# Altium project MCPS Power 0305.PrjPcb
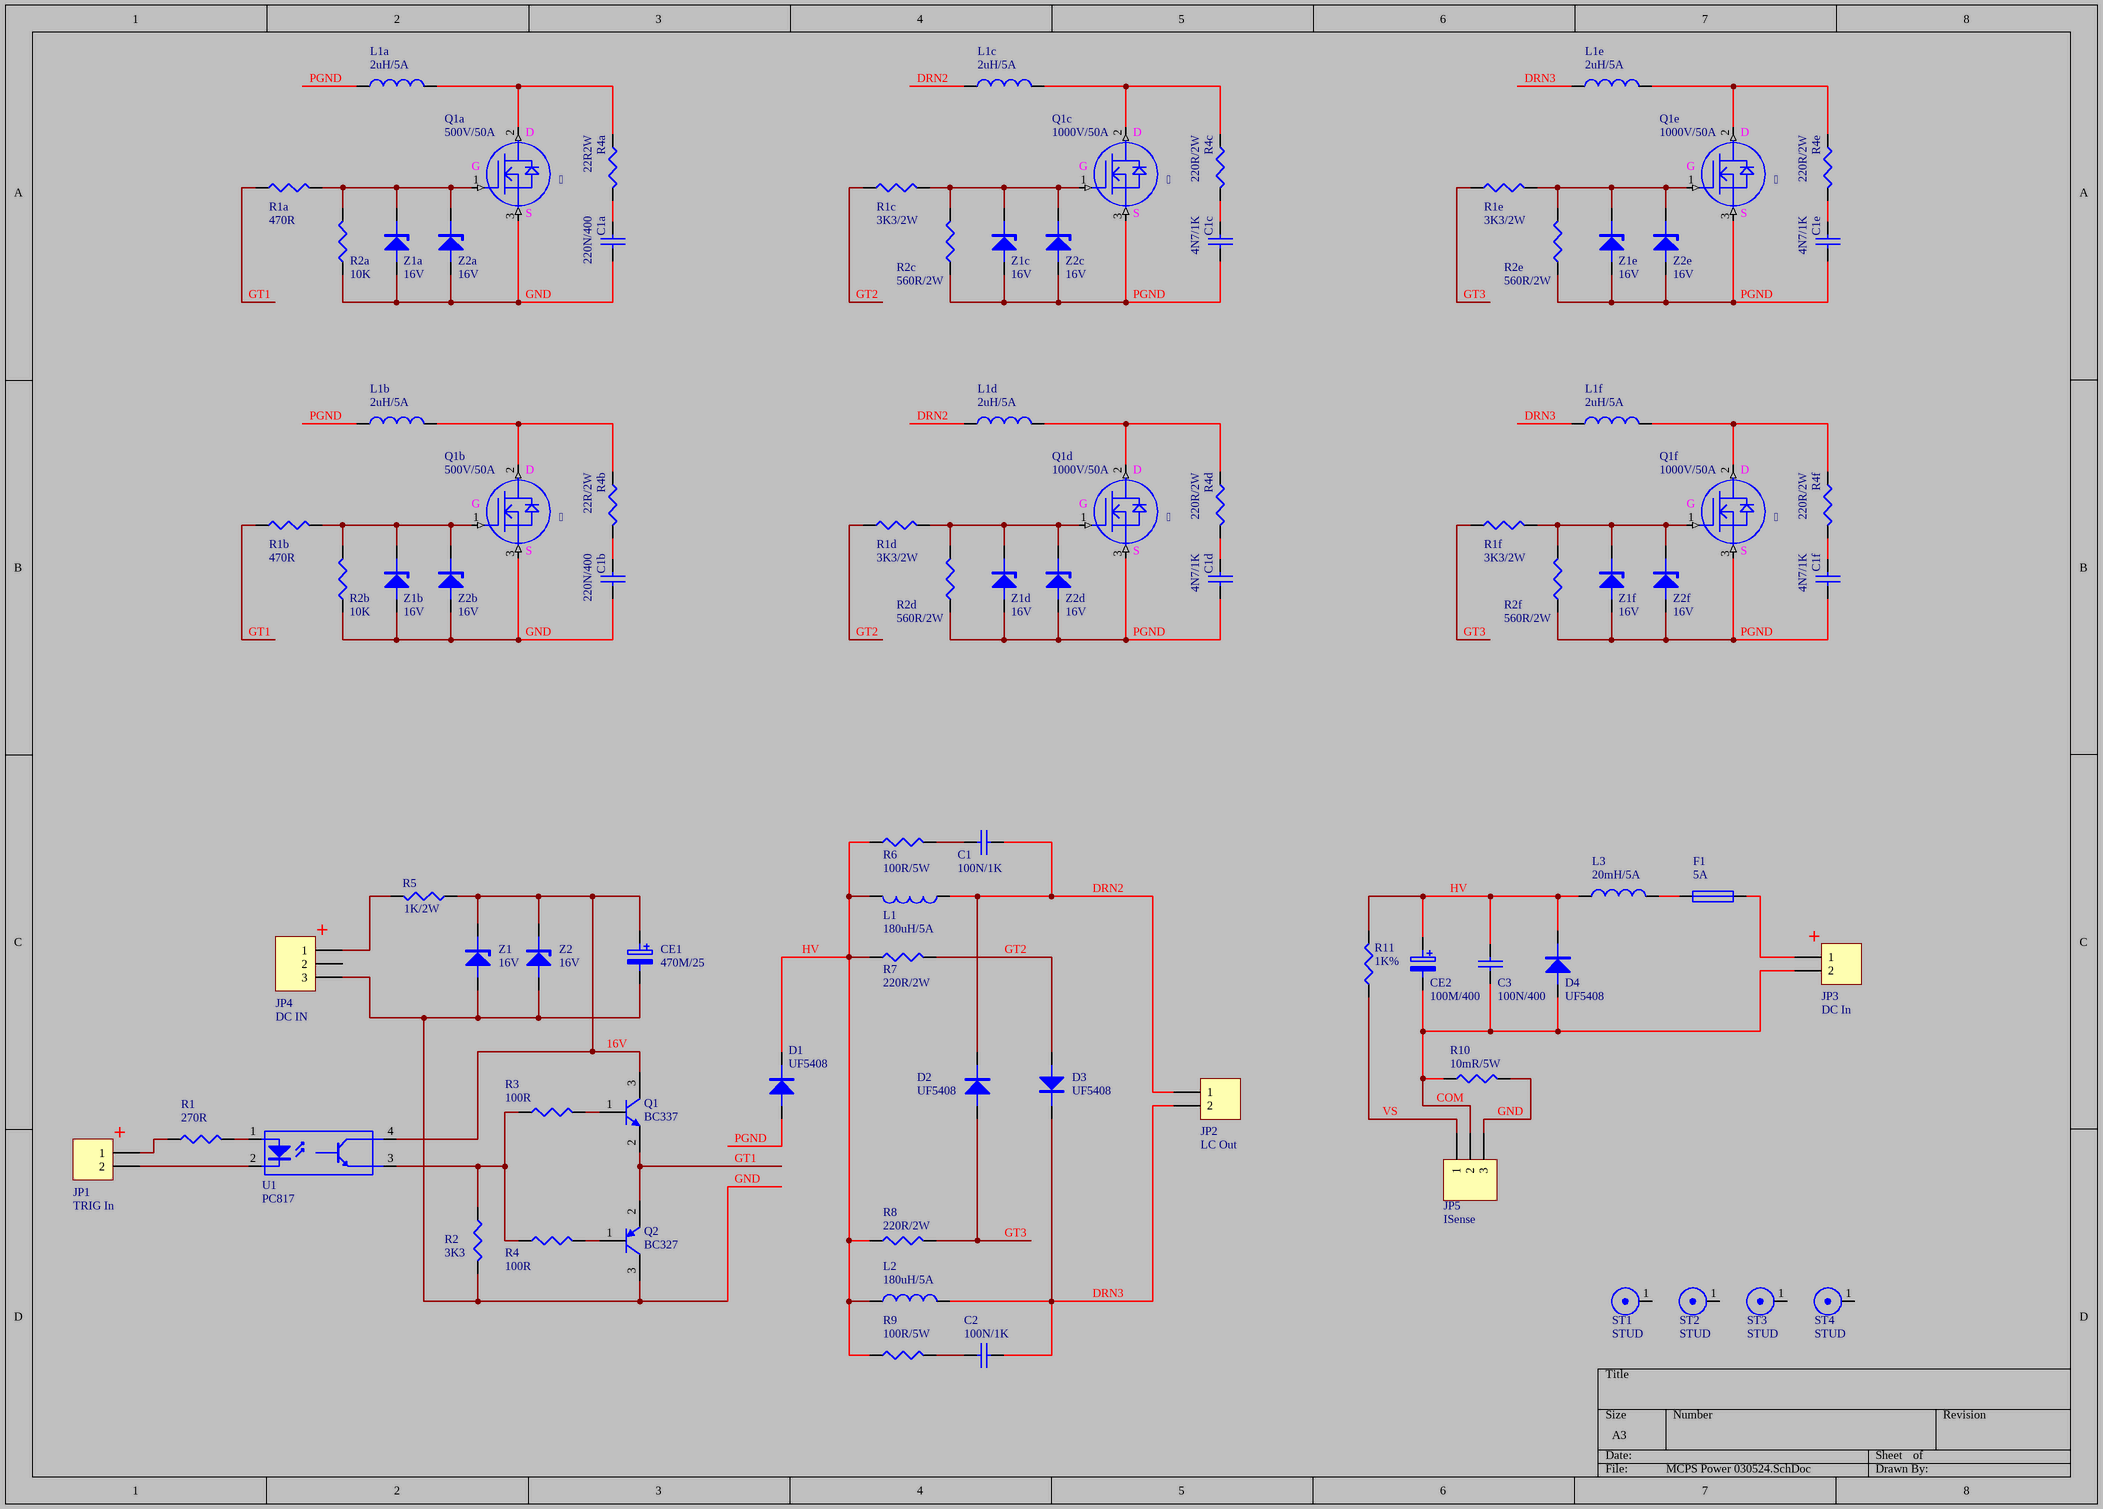
[diagram p0: MCPS Power 030524.SchDoc]
1 sheet, 86 parts. Net scope: global (net labels, ports and power ports of the same name join across sheets).
Board file: MCPS Power 030524.PcbDoc

## Sheet MCPS Power 030524.SchDoc
size A3

### Parts
C1  100N/1K  [C100N]
C1a  220N/400  [C4P]
C1b  220N/400  [C4P]
C1c  4N7/1K  [C4P]
C1d  4N7/1K  [C4P]
C1e  4N7/1K  [C4P]
C1f  4N7/1K  [C4P]
C2  100N/1K  [C100N]
C3  100N/400  [C4P]
CE1  470M/25  [cap2p12]
CE2  100M/400  [CAP3P5]
D1  UF5408  [D54]
D2  UF5408  [D54]
D3  UF5408  [D54]
D4  UF5408  [D54]
F1  5A  [FL]
JP1  TRIG In  [DSIP2]
JP2  LC Out  [DG55X2]
JP3  DC In  [DG55X2]
JP4  DC IN  [DSIP3]
JP5  ISense  [DSIP3]
L1  180uH/5A  [L20MHGREEN]
L1a  2uH/5A  [LS_GREEN]
L1b  2uH/5A  [LS_GREEN]
L1c  2uH/5A  [LS_GREEN]
L1d  2uH/5A  [LS_GREEN]
L1e  2uH/5A  [LS_GREEN]
L1f  2uH/5A  [LS_GREEN]
L2  180uH/5A  [L20MHGREEN]
L3  20mH/5A  [L20MHGREEN]
Q1  BC337  [CBE-BC546]
Q1a    [3EDG-STR]
Q1b    [3EDG-STR]
Q1c    [3EDG-STR]
Q1d    [3EDG-STR]
Q1e    [3EDG-STR]
Q1f    [3EDG-STR]
Q2  BC327  [CBE-BC546]
R1  270R  [W1/4]
R1a  470R  [R5P]
R1b  470R  [R5P]
R1c  3K3/2W  [R2W]
R1d  3K3/2W  [R2W]
R1e  3K3/2W  [R2W]
R1f  3K3/2W  [R2W]
R2  3K3  [W1/4]
R2a  10K  [R5P]
R2b  10K  [R5P]
R2c  560R/2W  [R2W]
R2d  560R/2W  [R2W]
R2e  560R/2W  [R2W]
R2f  560R/2W  [R2W]
R3  100R  [W1/4]
R4  100R  [W1/4]
R4a  22R2W  [R2W]
R4b  22R/2W  [R2W]
R4c  220R/2W  [R2W]
R4d  220R/2W  [R2W]
R4e  220R/2W  [R2W]
R4f  220R/2W  [R2W]
R5  1K/2W  [R2W]
R6  100R/5W  [R5W]
R7  220R/2W  [R2W]
R8  220R/2W  [R2W]
R9  100R/5W  [R5W]
R10  10mR/5W  [R5W]
R11  1K%  [R5P]
ST1  STUD  [CORNER]
ST2  STUD  [CORNER]
ST3  STUD  [CORNER]
ST4  STUD  [CORNER]
U1  PC817  [DIP4]
Z1  16V  [D5P]
Z1a  16V  [D5P]
Z1b  16V  [D5P]
Z1c  16V  [D5P]
Z1d  16V  [D5P]
Z1e  16V  [D5P]
Z1f  16V  [D5P]
Z2  16V  [D5P]
Z2a  16V  [D5P]
Z2b  16V  [D5P]
Z2c  16V  [D5P]
Z2d  16V  [D5P]
Z2e  16V  [D5P]
Z2f  16V  [D5P]

### Nets
16V: CE1.1 Q1.3(C) R5.1 U1.4(C) Z1.2(K) Z2.2(K)
COM: C3.2 CE2.2 D4.1(A) JP3.2 JP5.2 R10.1
DRN2: C1.2 D2.2(K) JP2.1 L1.2 L1c.1 L1d.1
DRN3: C2.2 D3.2(K) JP2.2 L1e.1 L1f.1 L2.2
GND: C1a.2 C1b.2 CE1.2 JP4.3 JP5.3 Q1a.3(S) Q1b.3(S) Q2.3(C) R2.2 R2a.1 R2b.1 R10.2 Z1.1(A) Z1a.1(A) Z1b.1(A) Z2.1(A) Z2a.1(A) Z2b.1(A)
GT1: Q1.2(E) Q2.2(B) R1a.1 R1b.1
GT2: D3.1(A) R1c.1 R1d.1 R7.2
GT3: D2.1(A) R1e.1 R1f.1 R8.2
HV: C3.1 CE2.1 D1.2(K) D4.2(K) L1.1 L2.1 L3.1 R6.1 R7.1 R8.1 R9.1 R11.2
PGND: C1c.2 C1d.2 C1e.2 C1f.2 D1.1(A) L1a.1 L1b.1 Q1c.3(S) Q1d.3(S) Q1e.3(S) Q1f.3(S) R2c.1 R2d.1 R2e.1 R2f.1 Z1c.1(A) Z1d.1(A) Z1e.1(A) Z1f.1(A) Z2c.1(A) Z2d.1(A) Z2e.1(A) Z2f.1(A)
VS: JP5.1 R11.1
NetC1_1: C1.1 R6.2
NetC1a_1: C1a.1 R4a.2
NetC1b_1: C1b.1 R4b.2
NetC1c_1: C1c.1 R4c.2
NetC1d_1: C1d.1 R4d.2
NetC1e_1: C1e.1 R4e.2
NetC1f_1: C1f.1 R4f.2
NetC2_1: C2.1 R9.2
NetF1_1: F1.1 L3.2
NetF1_2: F1.2 JP3.1
NetJP1_1: JP1.1 R1.1
NetJP1_2: JP1.2 U1.2(K)
NetJP4_1: JP4.1 R5.2
NetL1a_2: L1a.2 Q1a.2(D) R4a.1
NetL1b_2: L1b.2 Q1b.2(D) R4b.1
NetL1c_2: L1c.2 Q1c.2(D) R4c.1
NetL1d_2: L1d.2 Q1d.2(D) R4d.1
NetL1e_2: L1e.2 Q1e.2(D) R4e.1
NetL1f_2: L1f.2 Q1f.2(D) R4f.1
NetQ1_1: Q1.1(B) R3.2
NetQ1a_1: Q1a.1(G) R1a.2 R2a.2 Z1a.2(K) Z2a.2(K)
NetQ1b_1: Q1b.1(G) R1b.2 R2b.2 Z1b.2(K) Z2b.2(K)
NetQ1c_1: Q1c.1(G) R1c.2 R2c.2 Z1c.2(K) Z2c.2(K)
NetQ1d_1: Q1d.1(G) R1d.2 R2d.2 Z1d.2(K) Z2d.2(K)
NetQ1e_1: Q1e.1(G) R1e.2 R2e.2 Z1e.2(K) Z2e.2(K)
NetQ1f_1: Q1f.1(G) R1f.2 R2f.2 Z1f.2(K) Z2f.2(K)
NetQ2_1: Q2.1(E) R4.2
NetR1_2: R1.2 U1.1(A)
NetR2_1: R2.1 R3.1 R4.1 U1.3(E)

Not connected (* = marked no-connect by the designer): JP4 2; ST1 1; ST2 1; ST3 1; ST4 1

### Notes on the sheet
- (near Q1a) 500V/50A
- (near Q1a) G
- (near Q1a) D
- (near Q1c) 1000V/50A
- (near Q1c) G
- (near Q1c) D
- (near Q1e) 1000V/50A
- (near Q1e) G
- (near Q1e) D
- (near Q1a) S
- (near Q1c) S
- (near Q1e) S
- (near Q1b) 500V/50A
- (near Q1b) G
- (near Q1b) D
- (near Q1d) 1000V/50A
- (near Q1d) G
- (near Q1d) D
- (near Q1f) 1000V/50A
- (near Q1f) G
- (near Q1f) D
- (near Q1b) S
- (near Q1d) S
- (near Q1f) S
- (near JP4) +
- (near JP3) +
- (near JP1) +

### Library data of the parts
C1 C1a C1b C1c C1d C1e C1f C2 C3 = C
CE1 CE2 = E
D1-D4 = D
  D1 D2 D4: D4P: *
F1 = FUSE1
JP1-JP3 = Header 2: Header, 2-Pin; LatestRevisionDate: 17-Jul-2002; LatestRevisionNote: Re-released for DXP Platform.; Publisher: Altium Limited
JP4 JP5 = Header 3: Header, 3-Pin; LatestRevisionDate: 17-Jul-2002; LatestRevisionNote: Re-released for DXP Platform.; Publisher: Altium Limited
L1 L1a L1b L1c L1d L1e L1f L2 L3 = INDUCTOR
Q1 = BC546
Q1a Q1b Q1c Q1d Q1e Q1f = MOSFET N
Q2 = M6: PNP; Published: 8-Jun-2000; LatestRevisionDate: 15-Jan-2003; LatestRevisionNote: PCB Footprint 'BCY-W3/D4.7' replaced; DatasheetVersion: 1997; PackageVersion: Sep-1998; PackageReference: TO-92A; Publisher: Altium Limited; PackageDescription: TO, Flat Index; 3 In-Line, Axial Leads; Body Dia. 4.5mm; Leads 0.51 x 0.48 mm (max)
R1 R1a R1b R1c R1d R1e R1f R2 R2a R2b R2c R2d R2e R2f R3 R4 R4a R4b R4c R4d R4e R4f R5-R11 = R
U1 = OPTODIP4
Z1 Z1a Z1b Z1c Z1d Z1e Z1f Z2 Z2a Z2b Z2c Z2d Z2e Z2f = DZ